# EAGLE design PNP_Alignment_Fixture (EAGLE 9.6.2)
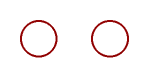
[diagram p0: schematic, sheet 1]

## Parts
U$1  FIDUCIAL_1MM  [FIDUCIAL_1MM]
U$2  FIDUCIAL_1MM  [FIDUCIAL_1MM]

## Library data of the parts
U$1 U$2 = 3D_MIG_Controller:FIDUCIAL_1MM: For use by pick and place machines to calibrate the vision/machine, 1mm By microbuilder.eu

## Board
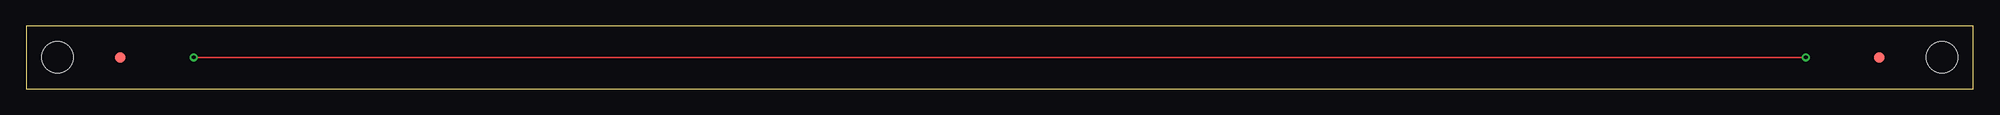
[diagram p1: board, top side]

Size 186 x 6 mm. Coordinates in mm from the lower left corner, seen from the top.
Outline: 0,0 186,0 186,6 0,6 0,0
Copper layers (1*16): Top 0.035mm / dielectric 1.5mm / Bottom 0.035mm
Design rules "default": minimum track width 6mil, minimum drill 0.35mm, track to track 6mil, track to pad 6mil, pad to pad 6mil, via to via 6mil, smd to smd 6mil, copper to edge 40mil, drill to drill 6mil, minimum pad ring 10mil, minimum via ring 8mil, stop-mask expansion 4mil, vias tented up to drill 0mil, thermal gap 10mil
Holes 3 mm at 3,3 183,3

### Footprints (pad centres in the part's own frame; a part is rotated, then mirrored left to right if it is on the bottom)
FIDUCIAL_1MM = smd 1 x 1: 1 0,0

### Placement (x,y rotation side)
U$1  9,3 0 top
U$2  177,3 0 top

### Tracks (layer width: path | path; a pad name or v marks a point on that pad's centre or on a via)
VDD  (via drill 0.35)
  Top 0.152: v16,3 v170,3